# Altium project LLA1305.PrjPcb (part 2 of 2)

## Sheet Power.SchDoc
size A4; SheetNumber: 4; SheetTotal: 11
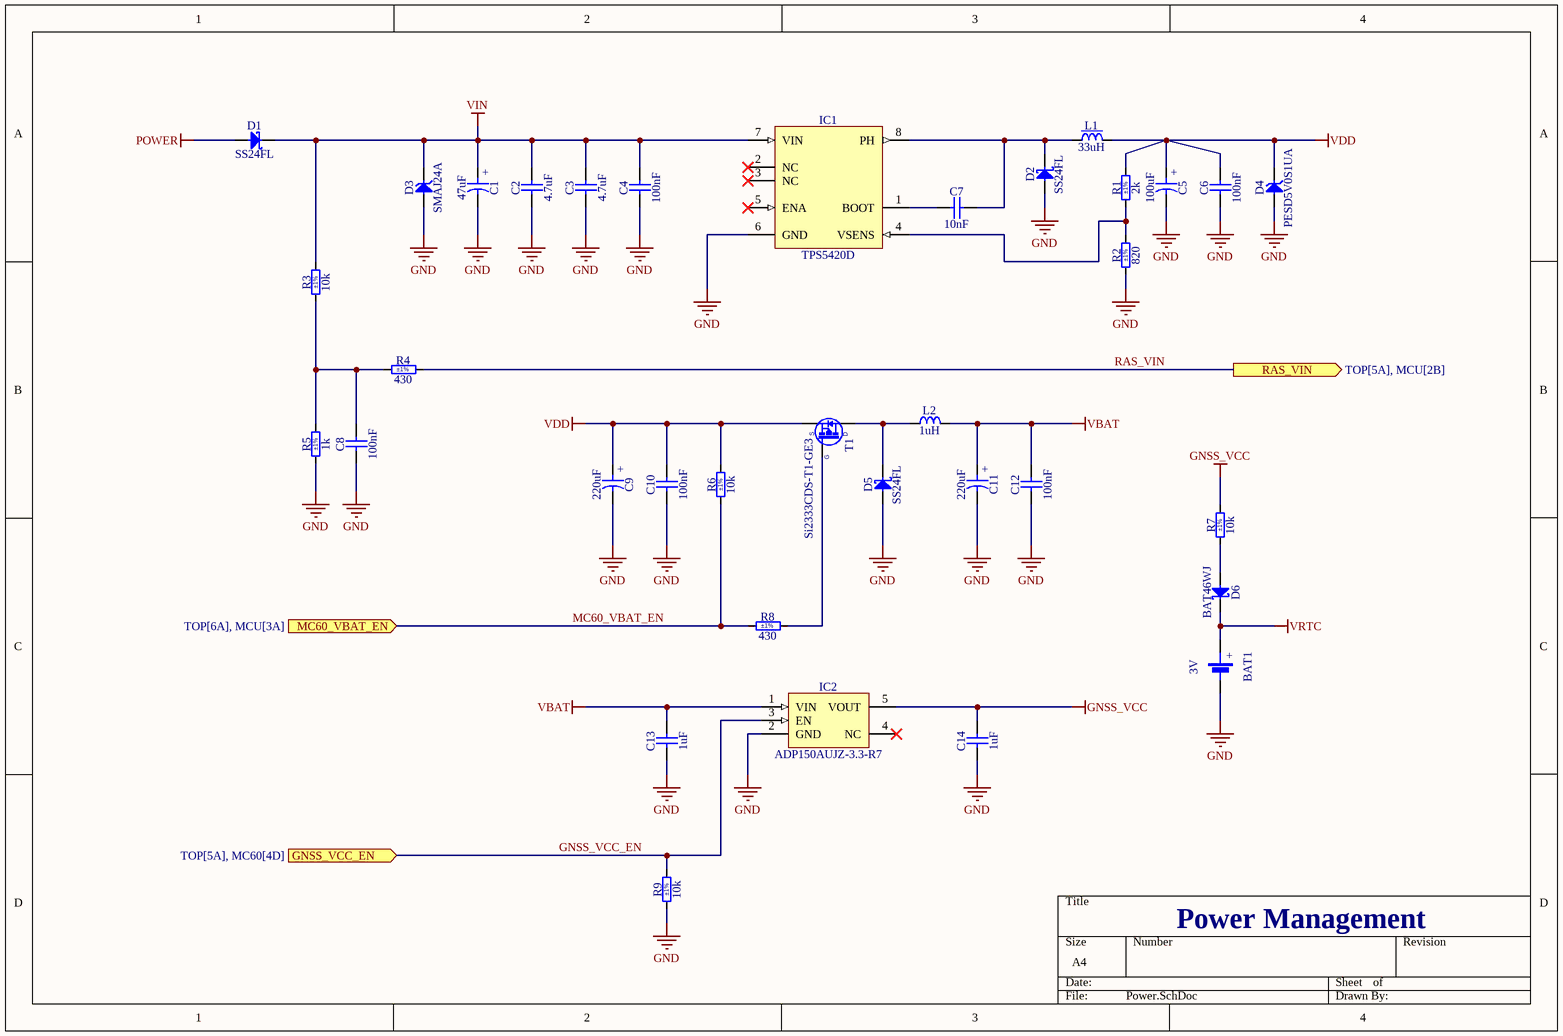
[diagram p7: Power.SchDoc]

### Parts
BAT1  3V  [BAT_SEIKO_ML414H_IV01E]
C1  47uF  [CAPAE660X540N]
C2  4.7uF  [CAPC5750X200N]
C3  4.7uF  [CAPC5750X200N]
C4  100nF  [CAPC1608X90N]
C5  100uF  [CAPMP7343X310N]
C6  100nF  [CAPC1608X87N]
C7  10nF  [CAPC1608X87N]
C8  100nF  [CAPC1608X87N]
C9  220uF  [CAPAE830X620N]
C10  100nF  [CAPC1608X87N]
C11  220uF  [CAPAE830X620N]
C12  100nF  [CAPC1608X87N]
C13  1uF  [CAPC1608X90N]
C14  1uF  [CAPC1608X90N]
D1  SS24FL  [SODFL3617X108N]
D2  SS24FL  [SODFL3617X108N]
D3  SMAJ24A  [DIOM5226X262N]
D4  PESD5V0S1UA  [SOD2512X110N]
D5  SS24FL  [SODFL3617X108N]
D6  BAT46WJ  [SODFL2513X80N]
IC1  TPS5420D  [SOIC127P600X175-8N]
IC2  ADP150AUJZ-3.3-R7  [SOT95P280X90-5N]
L1  33uH  [INDM7066X300N]
L2  1uH  [INDC2520X120N]
R1  2k  Tolerance: ±1%  [RESC1608X55N]
R2  820  Tolerance: ±1%  [RESC1608X55N]
R3  10k  Tolerance: ±1%  [RESC3216X65N]
R4  430  Tolerance: ±1%  [RESC1608X55N]
R5  1k  Tolerance: ±1%  [RESC1608X55N]
R6  10k  Tolerance: ±1%  [RESC1608X55N]
R7  10k  Tolerance: ±1%  [RESC1608X55N]
R8  430  Tolerance: ±1%  [RESC1608X55N]
R9  10k  Tolerance: ±1%  [RESC1608X55N]
T1  Si2333CDS-T1-GE3  [SOT95P237X112-3N]

### Ports
GNSS_VCC_EN (in, see TOP[5A], MC60[4D]), MC60_VBAT_EN (in, see TOP[6A], MCU[3A]), RAS_VIN (out, see TOP[5A], MCU[2B])

### Nets
GND: BAT1.2(MINUS) C1.2 C2.1 C3.1 C4.1 C5.2 C6.1 C8.1 C9.2 C10.1 C11.2 C12.1 C13.1 C14.1 D2.2(A) D3.2(A) D4.2(A) D5.2(A) IC1.6(GND) IC2.2(GND) R2.1 R5.1 R9.1
GNSS_VCC: C14.2 IC2.5(VOUT) R7.2
POWER: D1.2(A)
VBAT: C11.1 C12.2 C13.2 IC2.1(VIN) L2.2
VDD: C5.1 C6.2 C9.1 C10.2 D4.1(C) L1.2 R1.2 R6.2 T1.2(S)
VIN: C1.1 C2.2 C3.2 C4.2 D1.1(C) D3.1(C) IC1.7(VIN) R3.2
VRTC: BAT1.1(PLUS) D6.1(C)
GNSS_VCC_EN: IC2.3(EN) R9.2 ; port GNSS_VCC_EN
MC60_VBAT_EN: R6.1 R8.1 ; port MC60_VBAT_EN
RAS_VIN: R4.2 ; port RAS_VIN
NetC7_1: C7.1 IC1.1(BOOT)
NetC7_2: C7.2 D2.1(C) IC1.8(PH) L1.1
NetC8_2: C8.2 R3.1 R4.1 R5.2
NetD5_1: D5.1(C) L2.1 T1.3(D)
NetD6_2: D6.2(A) R7.1
NetIC1_4: IC1.4(VSENS) R1.1 R2.2
NetR8_2: R8.2 T1.1(G)

Not connected (* = marked no-connect by the designer): IC1 2(NC)* 3(NC)* 5(ENA)*; IC2 4(NC)*

### Notes on the sheet
- Power Management
- (in symbol BAT_SEIKO_ML414H_IV01E) +
- (in symbol CAE660-540_47UF_35V_20%) +
- (in symbol CAE830-620_220UF_10V_20%) +
- (in symbol CTE7343-31_100UF_10V_10%_LESR0050) +

### Library data of the parts
BAT1 = BAT_SEIKO_ML414H_IV01E: Battery 2 Pin; Part Description: Coin, 4.8mm 3 V Lithium Battery Rechargeable (Secondary) 1mAh; Manufacturer: Seiko Instruments; Manufacturer Part Number: ML414H IV01E; PressFit: No; Power: 1mAh; Part Number: BAT_SEIKO_ML414H_IV01E; Component Kind: Standard; Component Type: Standard; Pin Count: 2; PackageDescription: BATTERY LITHIUM 3V RECHARGE; Family: Battery; Mounted: Yes; Socket: No; SMD: Yes; Sense: No; Value: 3V; ComponentHeight: 4.8mm; HelpURL: https://media.digikey.com/PDF/Data%20Sheets/Seiko%20Instruments%20PDFs/ML414H_E.pdf; Author: Xusniyor; CreateDate: 23.04.2023; LatestRevisionDate: 23.04.2023
C1 = CAE660-540_47UF_35V_20%: Polarised capacitor; Part Description: Aluminum Electrolytic SMT Capacitor; Manufacturer: PANASONIC; Manufacturer Part Number: EEEFK1V470AP; Voltage: 35V; Tolerance: ±20%; Part Number: CAE660-540_47UF_35V_20%; Component Kind: Standard; Component Type: Standard; Pin Count: 2; Value: 47uF; Status: Not Recommended; Case: D; Mounted: Yes; Socket: No; SMD: Yes; Sense: No; ComponentHeight: 5.8mm; HelpURL: \\cern.ch\dfs\Applications\Altium\Datasheets\CAE_PANASONIC_FK-V.pdf; Author: CERN DEM JLC; CreateDate: 03.12.2007; LatestRevisionDate: 05.11.2014
C2 C3 = CC2220_4.7UF_100V_10%_X7R: Non-polarised capacitor; Part Description: Multilayer Ceramic Chip Capacitor; Manufacturer: GENERIC; Manufacturer1 Part Number: C5750X7R2A475K230KA; Voltage: 100V; TC: X7R; Tolerance: ±10%; Part Number: CC2220_4.7UF_100V_10%_X7R; Component Kind: Standard; Component Type: Standard; Pin Count: 2; Value: 4.7uF; Status: None; Manufacturer Part Number: CC2220_4.7UF_100V_10%_X7R; Case: 2220; Mounted: Yes; Socket: No; SMD: Yes; Sense: No; Manufacturer1 Example: TDK; Manufacturer1 ComponentHeight: 2.5mm; HelpURL: \\cern.ch\dfs\Applications\Altium\Datasheets\CC2220_X7R_TDK_C_Mid Voltage.pdf; Author: CERN DEM JLC; CreateDate: 31.03.2014; LatestRevisionDate: 30.01.2017
C4 = CC0603_100NF_100V_10%_X7R: Non-polarised capacitor; Part Description: SMD Multilayer Chip Ceramic Capacitor; Manufacturer: GENERIC; Manufacturer1 Part Number: GRM188R72A104KA35D; Voltage: 100V; TC: X7R; Tolerance: ±10%; Part Number: CC0603_100NF_100V_10%_X7R; Component Kind: Standard; Component Type: Standard; Pin Count: 2; Value: 100nF; Status: None; Manufacturer Part Number: CC0603_100NF_100V_10%_X7R; Case: 0603; Mounted: Yes; Socket: No; SMD: Yes; Sense: No; Manufacturer1 Example: MURATA; Manufacturer1 ComponentHeight: 0.9mm; HelpURL: \\cern.ch\dfs\Applications\Altium\Datasheets\CC0603_MURATA_GRM188R72A104KA35D.pdf; Author: CERN DEM JLC; CreateDate: 11.12.2013; LatestRevisionDate: 11.12.2013
C5 = CTE7343-31_100UF_10V_10%_LESR0050: Polarised capacitor; Part Description: Low ESR 0R050 Solid Tantalum Chip Capacitor; Manufacturer: GENERIC; Manufacturer1 Part Number: TPSD107K010R0050; Voltage: 10V; Tolerance: ±10%; Part Number: CTE7343-31_100UF_10V_10%_LESR0050; Component Kind: Standard; Component Type: Standard; Pin Count: 2; Value: 100uF; Status: Preferred; Manufacturer Part Number: CTE7343-31_100UF_10V_10%_LESR0050; Case: D; Mounted: Yes; Socket: No; SMD: Yes; Sense: No; Manufacturer1 Example: AVX; Manufacturer1 ComponentHeight: 3.1mm; HelpURL: \\cern.ch\dfs\Applications\Altium\Datasheets\CTE-LESR_AVX_TPS.pdf; Author: CERN DEM JLC; CreateDate: 05.05.2008; LatestRevisionDate: 20.01.2009
C6 C8 C10 C12 = CC0603_100NF_50V_10%_X7R: Non-polarised capacitor; Part Description: SMD Multilayer Chip Ceramic Capacitor; Manufacturer: GENERIC; Manufacturer1 Part Number: 223858615649; Voltage: 50V; TC: X7R; Tolerance: ±10%; Part Number: CC0603_100NF_50V_10%_X7R; Component Kind: Standard; Component Type: Standard; Pin Count: 2; Value: 100nF; Status: Preferred; Manufacturer Part Number: CC0603_100NF_50V_10%_X7R; Case: 0603; Mounted: Yes; Socket: No; SMD: Yes; Sense: No; Manufacturer1 Example: PHYCOMP; Manufacturer1 ComponentHeight: 0.87mm; HelpURL: \\cern.ch\dfs\Applications\Altium\Datasheets\CC0603_X7R_PHYCOMP.pdf; Author: CERN DEM JLC; CreateDate: 03.12.2007; LatestRevisionDate: 03.12.2007
C7 = CC0603_10NF_50V_10%_X7R: Non-polarised capacitor; Part Description: SMD Multilayer Chip Ceramic Capacitor; Manufacturer: GENERIC; Manufacturer1 Part Number: 223858615636; Voltage: 50V; TC: X7R; Tolerance: ±10%; Part Number: CC0603_10NF_50V_10%_X7R; Component Kind: Standard; Component Type: Standard; Pin Count: 2; Value: 10nF; Status: Preferred; Manufacturer Part Number: CC0603_10NF_50V_10%_X7R; Case: 0603; Mounted: Yes; Socket: No; SMD: Yes; Sense: No; Manufacturer1 Example: PHYCOMP; Manufacturer1 ComponentHeight: 0.87mm; HelpURL: \\cern.ch\dfs\Applications\Altium\Datasheets\CC0603_X7R_PHYCOMP.pdf; Author: CERN DEM JLC; CreateDate: 03.12.2007; LatestRevisionDate: 03.12.2007
C9 C11 = CAE830-620_220UF_10V_20%: Polarised capacitor; Part Description: Aluminum Electrolytic SMT Capacitor; Manufacturer: PANASONIC; Manufacturer Part Number: EEEFK1A221AP; Voltage: 10V; Tolerance: ±20%; Part Number: CAE830-620_220UF_10V_20%; Component Kind: Standard; Component Type: Standard; Pin Count: 2; Value: 220uF; Status: Not Recommended; Case: E; Mounted: Yes; Socket: No; SMD: Yes; Sense: No; ComponentHeight: 6.2mm; HelpURL: \\cern.ch\dfs\Applications\Altium\Datasheets\CAE_PANASONIC_FK-V.pdf; Author: CERN DEM JLC; CreateDate: 03.12.2007; LatestRevisionDate: 05.11.2014
C13 C14 = CC0603_1UF_50V_10%_X7R: Non-polarised capacitor; Part Description: SMD Multilayer Chip Ceramic Capacitor; Manufacturer: GENERIC; Manufacturer1 Part Number: CC0603KRX7R9BB105; Voltage: 50V; TC: X7R; Tolerance: ±10%; Part Number: CC0603_1UF_50V_10%_X7R; Component Kind: Standard; Component Type: Standard; Pin Count: 2; Value: 1uF; Status: None; Manufacturer Part Number: CC0603_1UF_50V_10%_X7R; Case: 0603; Mounted: Yes; Socket: No; SMD: Yes; Sense: No; Manufacturer1 Example: YAGEO PHYCOMP; Manufacturer1 ComponentHeight: 0.9mm; HelpURL: \\cern.ch\dfs\Applications\Altium\Datasheets\CC0603_X7R_PHYCOMP.pdf; Author: CERN DEM BC; CreateDate: 20.08.2020; LatestRevisionDate: 20.08.2020
D1 D2 D5 = SS24FL: Schottky Diode; Part Description: Surface Mount Schottky Barrier Rectifier; Manufacturer: ON SEMICONDUCTOR; Voltage: 40V; Power: 2A; PressFit: No; Bonding: No; Part Number: SS24FL; Component Kind: Standard; Component Type: Standard; Device: SS24FL; PackageDescription: SODFL Diode (SOD123FL); 2.75mm W X 1.72mm L X 1.08mm H body, IPC Medium Density; Manufacturer Part Number: SS24FL; Pin Count: 2; Case: SOD-123FL; Mounted: Yes; Socket: No; SMD: Yes; Sense: No; ComponentHeight: 1.08mm; HelpURL: \\cern.ch\dfs\Applications\Altium\Datasheets\SS24FL.pdf; Author: CERN DEM BC; CreateDate: 06.10.2020; LatestRevisionDate: 06.10.2020
D3 = SMAJ24A: Transient Voltage Suppressor Diode (Uni-Directional); Part Description: Surface Mount Uni-directional Transient Voltage Suppressor Diode; Manufacturer: BOURNS; Voltage: 24V; Power: 400W; PressFit: No; Bonding: No; Part Number: SMAJ24A; Component Kind: Standard; Component Type: Standard; Device: SMAJ24A; PackageDescription: DO-214-AC/SMA Diode, Molded Body; 5.21mm L X 2.605mm W X 2.62mm H, IPC Medium Density; Manufacturer Part Number: SMAJ24A; Pin Count: 2; Case: DO-214AC; Mounted: Yes; Socket: No; SMD: Yes; Sense: No; ComponentHeight: 2.62mm; HelpURL: \\cern.ch\dfs\Applications\Altium\Datasheets\SMAJ24A.pdf; Author: CERN DEM JLC; CreateDate: 27.06.2011; LatestRevisionDate: 27.06.2011
D4 = PESD5V0S1UA: Transient Voltage Suppressor Diode (Uni-Directional); Part Description: Unidirectional ESD Protection for Transient Voltage Suppression; Manufacturer: NXP SEMICONDUCTORS; Voltage: 5V; Power: 890W; PressFit: No; Bonding: No; Part Number: PESD5V0S1UA; Component Kind: Standard; Component Type: Standard; Device: PESD5V0S1UA; PackageDescription: Small Outline Diode (SOD-323), 1.70mm W X 1.25mm L X 1.10mm H body,  IPC Medium Density; Manufacturer Part Number: PESD5V0S1UA; Pin Count: 2; Case: SOD323; Mounted: Yes; Socket: No; SMD: Yes; Sense: No; ComponentHeight: 1.1mm; HelpURL: \\cern.ch\dfs\Applications\Altium\Datasheets\PESD5V0S1UA.pdf; Author: CERN DEM JLC; CreateDate: 28.08.2012; LatestRevisionDate: 18.09.2013
D6 = BAT46WJ: Schottky Diode; Part Description: Single Schottky Barrier Diode; Manufacturer: NEXPERIA; Voltage: 100V; Power: 250mA; PressFit: No; Bonding: No; Part Number: BAT46WJ; Component Kind: Standard; Component Type: Standard; Device: BAT46WJ; PackageDescription: SODFL Diode (SOD323F); 1.70mm W X 1.25mm L X 0.80mm H body, IPC Medium Density; Manufacturer Part Number: BAT46WJ; Pin Count: 2; Case: SOD-323F; Mounted: Yes; Socket: No; SMD: Yes; Sense: No; ComponentHeight: 0.8mm; HelpURL: \\cern.ch\dfs\Applications\Altium\Datasheets\BAT46WJ.pdf; Author: CERN DEM JLC; CreateDate: 18.01.2018; LatestRevisionDate: 18.01.2018
IC1 = TPS5420D: 2A, Wide Input Range, Step-Down SWIFT Converter; Manufacturer: TEXAS INSTRUMENTS; PressFit: No; Bonding: No; Part Number: TPS5420D; Component Kind: Standard; Component Type: Standard; Device: TPS5420D; PackageDescription: SOIC 8, Pitch 1.27mm, Body 4x5mm, IPC Medium Density; Part Description: 2A, Wide Input Range, Step-Down SWIFT Converter; Manufacturer Part Number: TPS5420D; Pin Count: 8; Case: SOIC8; Mounted: Yes; Socket: No; SMD: Yes; Sense: No; ComponentHeight: 1.75mm; HelpURL: \\cern.ch\dfs\Applications\Altium\Datasheets\TPS5420D.pdf; Author: CERN DEM JLC; CreateDate: 17.11.2009; LatestRevisionDate: 07.12.2011
IC2 = ADP150AUJZ-3.3-R7: Ultralow Noise, 150 mA CMOS Linear Regulator; Part Description: 3.3V, 150mA, Ultralow Noise, CMOS Linear Regulator; Manufacturer: ANALOG DEVICES; PressFit: No; Bonding: No; Part Number: ADP150AUJZ-3.3-R7; Component Kind: Standard; Component Type: Standard; Device: ADP150AUJZ-3.3-R7; PackageDescription: SOT23, 0.95mm pitch; 5 pin, 1.75mm W X 3.00mm L, IPC Medium Density; Manufacturer Part Number: ADP150AUJZ-3.3-R7; Pin Count: 5; Case: SOT23; Mounted: Yes; Socket: No; SMD: Yes; Sense: No; ComponentHeight: 0.9mm; HelpURL: \\cern.ch\dfs\Applications\Altium\Datasheets\ADP150AUJZ-3.3-R7.pdf; Author: CERN DEM JLC; CreateDate: 27.09.2011; LatestRevisionDate: 19.06.2014
L1 = IND_33UH_20%_FXL0630-330-M: Inductor With Core; Part Description: 2A 33uH ±20% 2.5A SMD,6.6x7mm Power Inductors ROHS; Manufacturer: Changjiang Microelectronics Tech; Power: 2A; Resistance: 0.280R; Tolerance: ±20%; Part Number: IND_33UH_20%_FXL0630-330-M; Component Kind: Standard; Component Type: Standard; Pin Count: 2; Value: 33uH; Manufacturer Part Number: FXL0630-330-M; Case: 6.6x7; Mounted: Yes; Socket: No; SMD: Yes; Sense: No; ComponentHeight: 2.8mm; HelpURL: https://datasheet.lcsc.com/lcsc/1810111121_cjiang--Changjiang-Microelectronics-Tech-FXL0630-330-M_C177245.pdf; Author: Xusniyor; CreateDate: 01.05.2023; LatestRevisionDate: 01.05.2023
L2 = IND1008_1UH_20%_MURATA_DFE252012P-1R0M=P2: Inductor; Part Description: 1 µH Shielded Drum Core, Wirewound Inductor 4.3 A 42mOhm Max 1008 (2520 Metric); Manufacturer: MURATA; Power: 4.3A; Resistance: 0.042A; Tolerance: ±20%; Part Number: IND1008_1UH_20%_MURATA_DFE252012P-1R0M=P2; Component Kind: Standard; Component Type: Standard; Pin Count: 2; Value: 1uH; Manufacturer Part Number: DFE252012P-1R0M=P2; Case: 1008; Mounted: Yes; Socket: No; SMD: Yes; Sense: No; ComponentHeight: 1.2mm; HelpURL: https://www.murata.com/~/media/webrenewal/products/inductor/chip/tokoproducts/wirewoundmetalalloychiptype/m_dfe252012p.ashx; Author: Xusniyor; CreateDate: 12.02.2023; LatestRevisionDate: 12.02.2023
R1 = R0603_2K_1%_0.1W_100PPM: Resistor - 1%; Part Description: General Purpose Thick Film Chip Resistor; Manufacturer: GENERIC; Manufacturer1 Part Number: NRC06F2001TRF; Power: 0.1W; TC: ±100ppm/°C; PressFit: No; Part Number: R0603_2K_1%_0.1W_100PPM; Component Kind: Standard; Component Type: Standard; Pin Count: 2; Value: 2k; Status: Preferred; Manufacturer Part Number: R0603_2K_1%_0.1W_100PPM; Case: 0603; Mounted: Yes; Sense: No; Socket: No; SMD: Yes; Manufacturer1 Example: NIC COMPONENT; Manufacturer1 ComponentHeight: 0.55mm; HelpURL: \\cern.ch\dfs\Applications\Altium\Datasheets\R0603_NIC_NRC.pdf; Author: CERN DEM JLC; CreateDate: 03.12.2007; LatestRevisionDate: 13.03.2008
R2 = R0603_820R_1%_0.1W_100PPM: Resistor - 1%; Part Description: General Purpose Thick Film Chip Resistor; Manufacturer: GENERIC; Manufacturer1 Part Number: NRC06F8200TRF; Power: 0.1W; TC: ±100ppm/°C; PressFit: No; Part Number: R0603_820R_1%_0.1W_100PPM; Component Kind: Standard; Component Type: Standard; Pin Count: 2; Value: 820; Status: Preferred; Manufacturer Part Number: R0603_820R_1%_0.1W_100PPM; Case: 0603; Mounted: Yes; Sense: No; Socket: No; SMD: Yes; Manufacturer1 Example: NIC COMPONENT; Manufacturer1 ComponentHeight: 0.55mm; HelpURL: \\cern.ch\dfs\Applications\Altium\Datasheets\R0603_NIC_NRC.pdf; Author: CERN DEM JLC; CreateDate: 03.12.2007; LatestRevisionDate: 13.03.2008
R3 = R1206_10K_1%_0.25W_100PPM: Resistor - 1%; Part Description: General Purpose Thick Film Chip Resistor; Manufacturer: GENERIC; Manufacturer1 Part Number: NRC12F1002TRF; Power: 0.25W; TC: ±100ppm/°C; PressFit: No; Part Number: R1206_10K_1%_0.25W_100PPM; Component Kind: Standard; Component Type: Standard; Pin Count: 2; Value: 10k; Status: Preferred; Manufacturer Part Number: R1206_10K_1%_0.25W_100PPM; Case: 1206; Mounted: Yes; Sense: No; Socket: No; SMD: Yes; Manufacturer1 Example: NIC COMPONENT; Manufacturer1 ComponentHeight: 0.65mm; HelpURL: \\cern.ch\dfs\Applications\Altium\Datasheets\R1206_NIC_NRC.pdf; Author: CERN DEM JLC; CreateDate: 03.12.2007; LatestRevisionDate: 13.03.2008
R4 R8 = R0603_430R_1%_0.1W_100PPM: Resistor - 1%; Part Description: General Purpose Thick Film Chip Resistor; Manufacturer: GENERIC; Manufacturer1 Part Number: NRC06F4300TRF; Power: 0.1W; TC: ±100ppm/°C; PressFit: No; Part Number: R0603_430R_1%_0.1W_100PPM; Component Kind: Standard; Component Type: Standard; Pin Count: 2; Value: 430; Status: Preferred; Manufacturer Part Number: R0603_430R_1%_0.1W_100PPM; Case: 0603; Mounted: Yes; Sense: No; Socket: No; SMD: Yes; Manufacturer1 Example: NIC COMPONENT; Manufacturer1 ComponentHeight: 0.55mm; HelpURL: \\cern.ch\dfs\Applications\Altium\Datasheets\R0603_NIC_NRC.pdf; Author: CERN DEM JLC; CreateDate: 03.12.2007; LatestRevisionDate: 13.03.2008
R5 = R0603_1K_1%_0.1W_100PPM: Resistor - 1%; Part Description: General Purpose Thick Film Chip Resistor; Manufacturer: GENERIC; Manufacturer1 Part Number: NRC06F1001TRF; Power: 0.1W; TC: ±100ppm/°C; PressFit: No; Part Number: R0603_1K_1%_0.1W_100PPM; Component Kind: Standard; Component Type: Standard; Pin Count: 2; Value: 1k; Status: Preferred; Manufacturer Part Number: R0603_1K_1%_0.1W_100PPM; Case: 0603; Mounted: Yes; Sense: No; Socket: No; SMD: Yes; Manufacturer1 Example: NIC COMPONENT; Manufacturer1 ComponentHeight: 0.55mm; HelpURL: \\cern.ch\dfs\Applications\Altium\Datasheets\R0603_NIC_NRC.pdf; Author: CERN DEM JLC; CreateDate: 03.12.2007; LatestRevisionDate: 13.03.2008
R6 R7 R9 = R0603_10K_1%_0.1W_100PPM: Resistor - 1%; Part Description: General Purpose Thick Film Chip Resistor; Manufacturer: GENERIC; Manufacturer1 Part Number: NRC06F1002TRF; Power: 0.1W; TC: ±100ppm/°C; PressFit: No; Part Number: R0603_10K_1%_0.1W_100PPM; Component Kind: Standard; Component Type: Standard; Pin Count: 2; Value: 10k; Status: Preferred; Manufacturer Part Number: R0603_10K_1%_0.1W_100PPM; Case: 0603; Mounted: Yes; Sense: No; Socket: No; SMD: Yes; Manufacturer1 Example: NIC COMPONENT; Manufacturer1 ComponentHeight: 0.55mm; HelpURL: \\cern.ch\dfs\Applications\Altium\Datasheets\R0603_NIC_NRC.pdf; Author: CERN DEM JLC; CreateDate: 03.12.2007; LatestRevisionDate: 13.03.2008
T1 = Si2333CDS-T1-GE3: P-CHANNEL MOSFET WITH DIODE; Part Description: -12V -5.1A P-Channel  TrenchFET® Power MOSFET; Manufacturer: VISHAY SILICONIX; PressFit: No; Bonding: No; Part Number: Si2333CDS-T1-GE3; Component Kind: Standard; Component Type: Standard; Device: Si2333CDS-T1-GE3; PackageDescription: SOT23, 0.95mm Pitch; 3 Pin, 1.30mm W X 2.92mm L X 1.12mm H body, IPC Medium Density; Manufacturer Part Number: Si2333CDS-T1-GE3; Pin Count: 3; Case: SOT23-3; Mounted: Yes; Socket: No; SMD: Yes; Sense: No; ComponentHeight: 1.12mm; HelpURL: \\cern.ch\dfs\Applications\Altium\Datasheets\Si2333CDS-T1-GE3.pdf; Author: CERN DEM JLC; CreateDate: 03.03.2011; LatestRevisionDate: 02.05.2011

## Sheet RS485.SchDoc
size A4; SheetNumber: 10; SheetTotal: 11
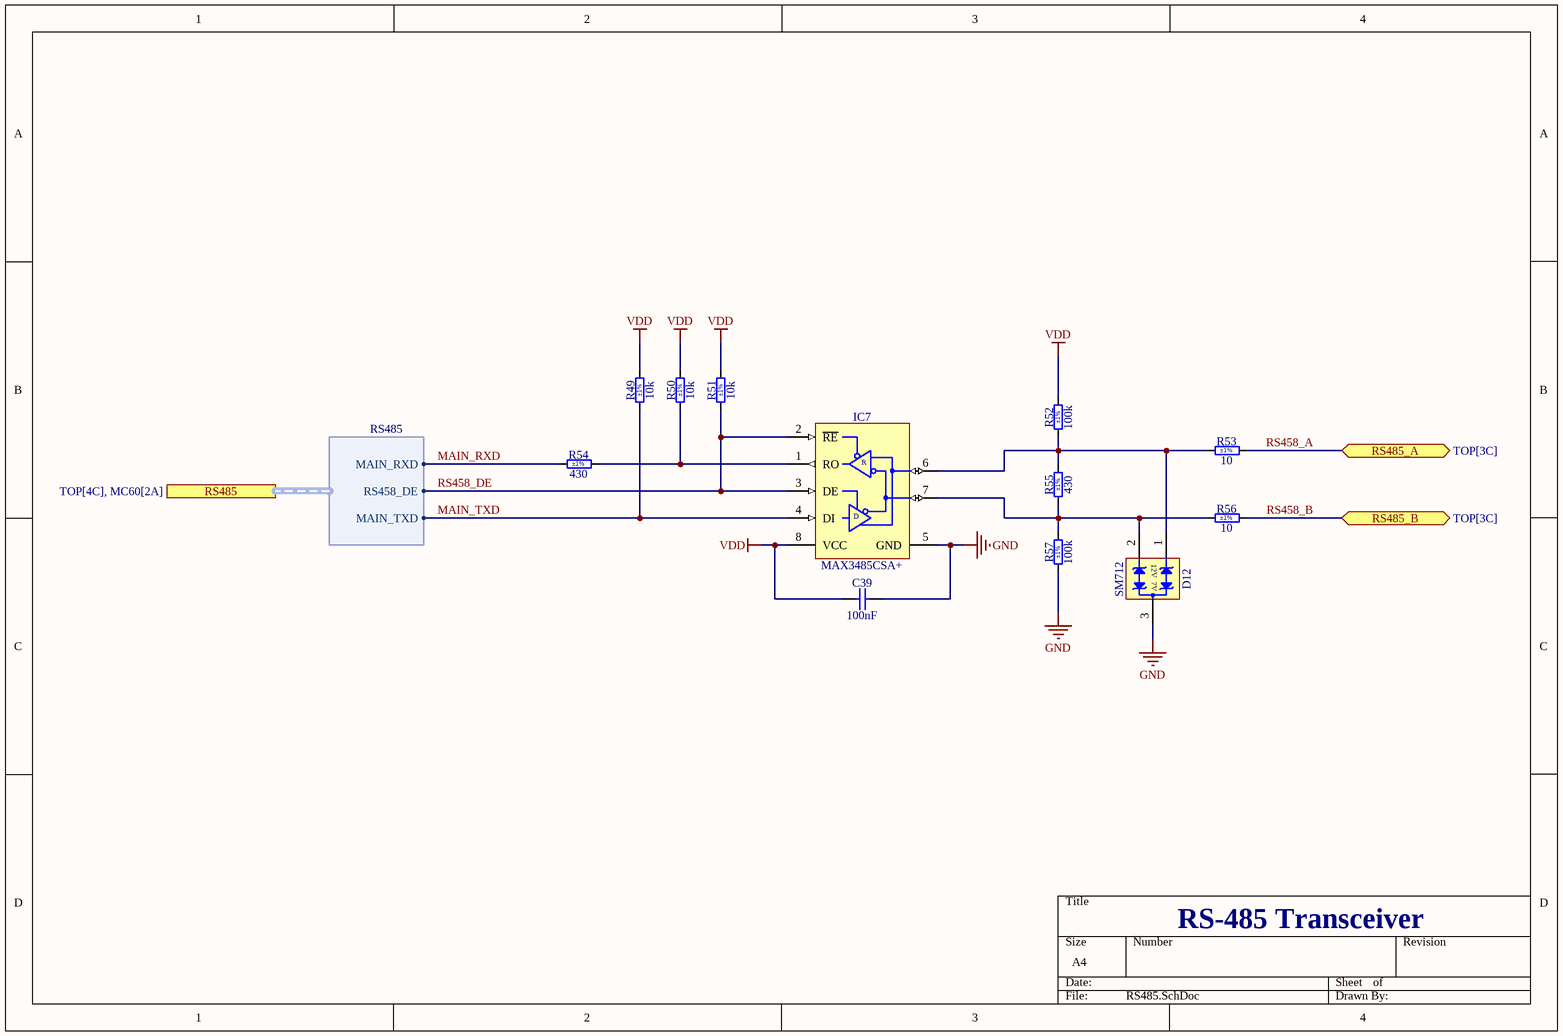
[diagram p8: RS485.SchDoc]

### Parts
C39  100nF  [CAPC1608X87N]
D12  SM712  [SOT95P237X112-3N]
IC7  MAX3485CSA+  [SOIC127P600X175-8N]
R49  10k  Tolerance: ±1%  [RESC1608X55N]
R50  10k  Tolerance: ±1%  [RESC1608X55N]
R51  10k  Tolerance: ±1%  [RESC1608X55N]
R52  100k  Tolerance: ±1%  [RESC1608X55N]
R53  10  Tolerance: ±1%  [RESC1608X55N]
R54  430  Tolerance: ±1%  [RESC1608X55N]
R55  430  Tolerance: ±1%  [RESC1608X55N]
R56  10  Tolerance: ±1%  [RESC1608X55N]
R57  100k  Tolerance: ±1%  [RESC1608X55N]

### Ports
RS485 (harness RS485, see TOP[4C], MC60[2A]), RS485_A (bidir, see TOP[3C]), RS485_B (bidir, see TOP[3C])

### Harnesses
RS485: MAIN_RXD, RS458_DE, MAIN_TXD

### Nets
GND: C39.2 D12.3(GND) IC7.5(GND) R57.1
VDD: C39.1 IC7.8(VCC) R49.2 R50.2 R51.2 R52.2
MAIN_RXD: R54.1 ; port RS485.MAIN_RXD
MAIN_TXD: IC7.4(DI) R49.1 ; port RS485.MAIN_TXD
RS458_A: R53.2 ; port RS485_A
RS458_B: R56.2 ; port RS485_B
RS458_DE: IC7.2(~{RE}) IC7.3(DE) R51.1 ; port RS485.RS458_DE
NetD12_1: D12.1(I/O1) IC7.6(A) R52.1 R53.1 R55.2
NetD12_2: D12.2(I/O2) IC7.7(B) R55.1 R56.1 R57.2
NetIC7_1: IC7.1(RO) R50.1 R54.2

### Notes on the sheet
- RS-485 Transceiver
- (in symbol MAX3485CSA+) R; D
- (in symbol SM712) 12V; 7V

### Library data of the parts
C39 = CC0603_100NF_50V_10%_X7R: as C6 on sheet Power; Part Number: CC0603_100NF_50V_10%_X7R; Component Kind: Standard; Component Type: Standard; Pin Count: 2; Value: 100nF; Status: Preferred; Manufacturer Part Number: CC0603_100NF_50V_10%_X7R; Case: 0603; Mounted: Yes; Socket: No; SMD: Yes; Sense: No; Manufacturer1 Example: PHYCOMP; Manufacturer1 ComponentHeight: 0.87mm; HelpURL: \\cern.ch\dfs\Applications\Altium\Datasheets\CC0603_X7R_PHYCOMP.pdf; Author: CERN DEM JLC; CreateDate: 03.12.2007; LatestRevisionDate: 03.12.2007
D12 = SM712: Asymmetrical TVS Diode for Extended Common-Mode RS-485; Manufacturer: SEMTECH; Voltage: 12V/-7V; Power: 400W; PressFit: No; Bonding: No; Part Number: SM712; Component Kind: Standard; Component Type: Standard; Device: SM712; PackageDescription: SOT, 0.95mm Pitch; 3 Pin, 1.30mm W X 2.92mm L X 1.12mm H body, IPC Medium Density; Status: Obsolete; Part Description: Asymmetrical TVS Diode for Extended Common-Mode RS-485; Manufacturer Part Number: SM712; Pin Count: 3; Case: SOT23-3; Mounted: Yes; Socket: No; SMD: Yes; Sense: No; ComponentHeight: 1.12mm; HelpURL: \\cern.ch\dfs\Applications\Altium\Datasheets\SM712.pdf; Author: CERN DEM JLC; CreateDate: 23.04.2012; LatestRevisionDate: 23.04.2012
IC7 = MAX3485CSA+: 3.3V-Powered, ±15kV ESD-Protected, 10Mbps,True RS-485/RS-422 Half Duplex Transceiver; Manufacturer: MAXIM; PressFit: No; Bonding: No; Part Number: MAX3485CSA+; Component Kind: Standard; Component Type: Standard; Device: MAX3485CSA+; PackageDescription: SOIC, 1.27mm Pitch; 8 Pin - Body 4x5mm, IPC Medium Density; Part Description: 3.3V-Powered, ±15kV ESD-Protected, 10Mbps,True RS-485/RS-422 Half Duplex Transceiver; Manufacturer Part Number: MAX3485CSA+; Pin Count: 8; Case: SOIC8; Mounted: Yes; Socket: No; SMD: Yes; Sense: No; ComponentHeight: 1.75mm; HelpURL: \\cern.ch\dfs\Applications\Altium\Datasheets\MAX3485CSA+.pdf; Author: CERN DEM JLC; CreateDate: 05.10.2009; LatestRevisionDate: 05.10.2009
R49-R51 = R0603_10K_1%_0.1W_100PPM: as R6 on sheet Power; Part Number: R0603_10K_1%_0.1W_100PPM; Component Kind: Standard; Component Type: Standard; Pin Count: 2; Value: 10k; Status: Preferred; Manufacturer Part Number: R0603_10K_1%_0.1W_100PPM; Case: 0603; Mounted: Yes; Sense: No; Socket: No; SMD: Yes; Manufacturer1 Example: NIC COMPONENT; Manufacturer1 ComponentHeight: 0.55mm; HelpURL: \\cern.ch\dfs\Applications\Altium\Datasheets\R0603_NIC_NRC.pdf; Author: CERN DEM JLC; CreateDate: 03.12.2007; LatestRevisionDate: 13.03.2008
R52 R57 = R0603_100K_1%_0.1W_100PPM: Resistor - 1%; Part Description: General Purpose Thick Film Chip Resistor; Manufacturer: GENERIC; Manufacturer1 Part Number: NRC06F1003TRF; Power: 0.1W; TC: ±100ppm/°C; PressFit: No; Part Number: R0603_100K_1%_0.1W_100PPM; Component Kind: Standard; Component Type: Standard; Pin Count: 2; Value: 100k; Status: Preferred; Manufacturer Part Number: R0603_100K_1%_0.1W_100PPM; Case: 0603; Mounted: Yes; Sense: No; Socket: No; SMD: Yes; Manufacturer1 Example: NIC COMPONENT; Manufacturer1 ComponentHeight: 0.55mm; HelpURL: \\cern.ch\dfs\Applications\Altium\Datasheets\R0603_NIC_NRC.pdf; Author: CERN DEM JLC; CreateDate: 03.12.2007; LatestRevisionDate: 13.03.2008
R53 R56 = R0603_10R_1%_0.1W_200PPM: Resistor - 1%; Part Description: General Purpose Thick Film Chip Resistor; Manufacturer: GENERIC; Manufacturer1 Part Number: NRC06F10R0TRF; Power: 0.1W; TC: ±200ppm/°C; PressFit: No; Part Number: R0603_10R_1%_0.1W_200PPM; Component Kind: Standard; Component Type: Standard; Pin Count: 2; Value: 10; Status: Preferred; Manufacturer Part Number: R0603_10R_1%_0.1W_200PPM; Case: 0603; Mounted: Yes; Sense: No; Socket: No; SMD: Yes; Manufacturer1 Example: NIC COMPONENT; Manufacturer1 ComponentHeight: 0.55mm; HelpURL: \\cern.ch\dfs\Applications\Altium\Datasheets\R0603_NIC_NRC.pdf; Author: CERN DEM JLC; CreateDate: 03.12.2007; LatestRevisionDate: 24.06.2009
R54 R55 = R0603_430R_1%_0.1W_100PPM: as R4 on sheet Power; Part Number: R0603_430R_1%_0.1W_100PPM; Component Kind: Standard; Component Type: Standard; Pin Count: 2; Value: 430; Status: Preferred; Manufacturer Part Number: R0603_430R_1%_0.1W_100PPM; Case: 0603; Mounted: Yes; Sense: No; Socket: No; SMD: Yes; Manufacturer1 Example: NIC COMPONENT; Manufacturer1 ComponentHeight: 0.55mm; HelpURL: \\cern.ch\dfs\Applications\Altium\Datasheets\R0603_NIC_NRC.pdf; Author: CERN DEM JLC; CreateDate: 03.12.2007; LatestRevisionDate: 13.03.2008

## Sheet IOs.SchDoc
size A3; SheetNumber: 8; SheetTotal: 11
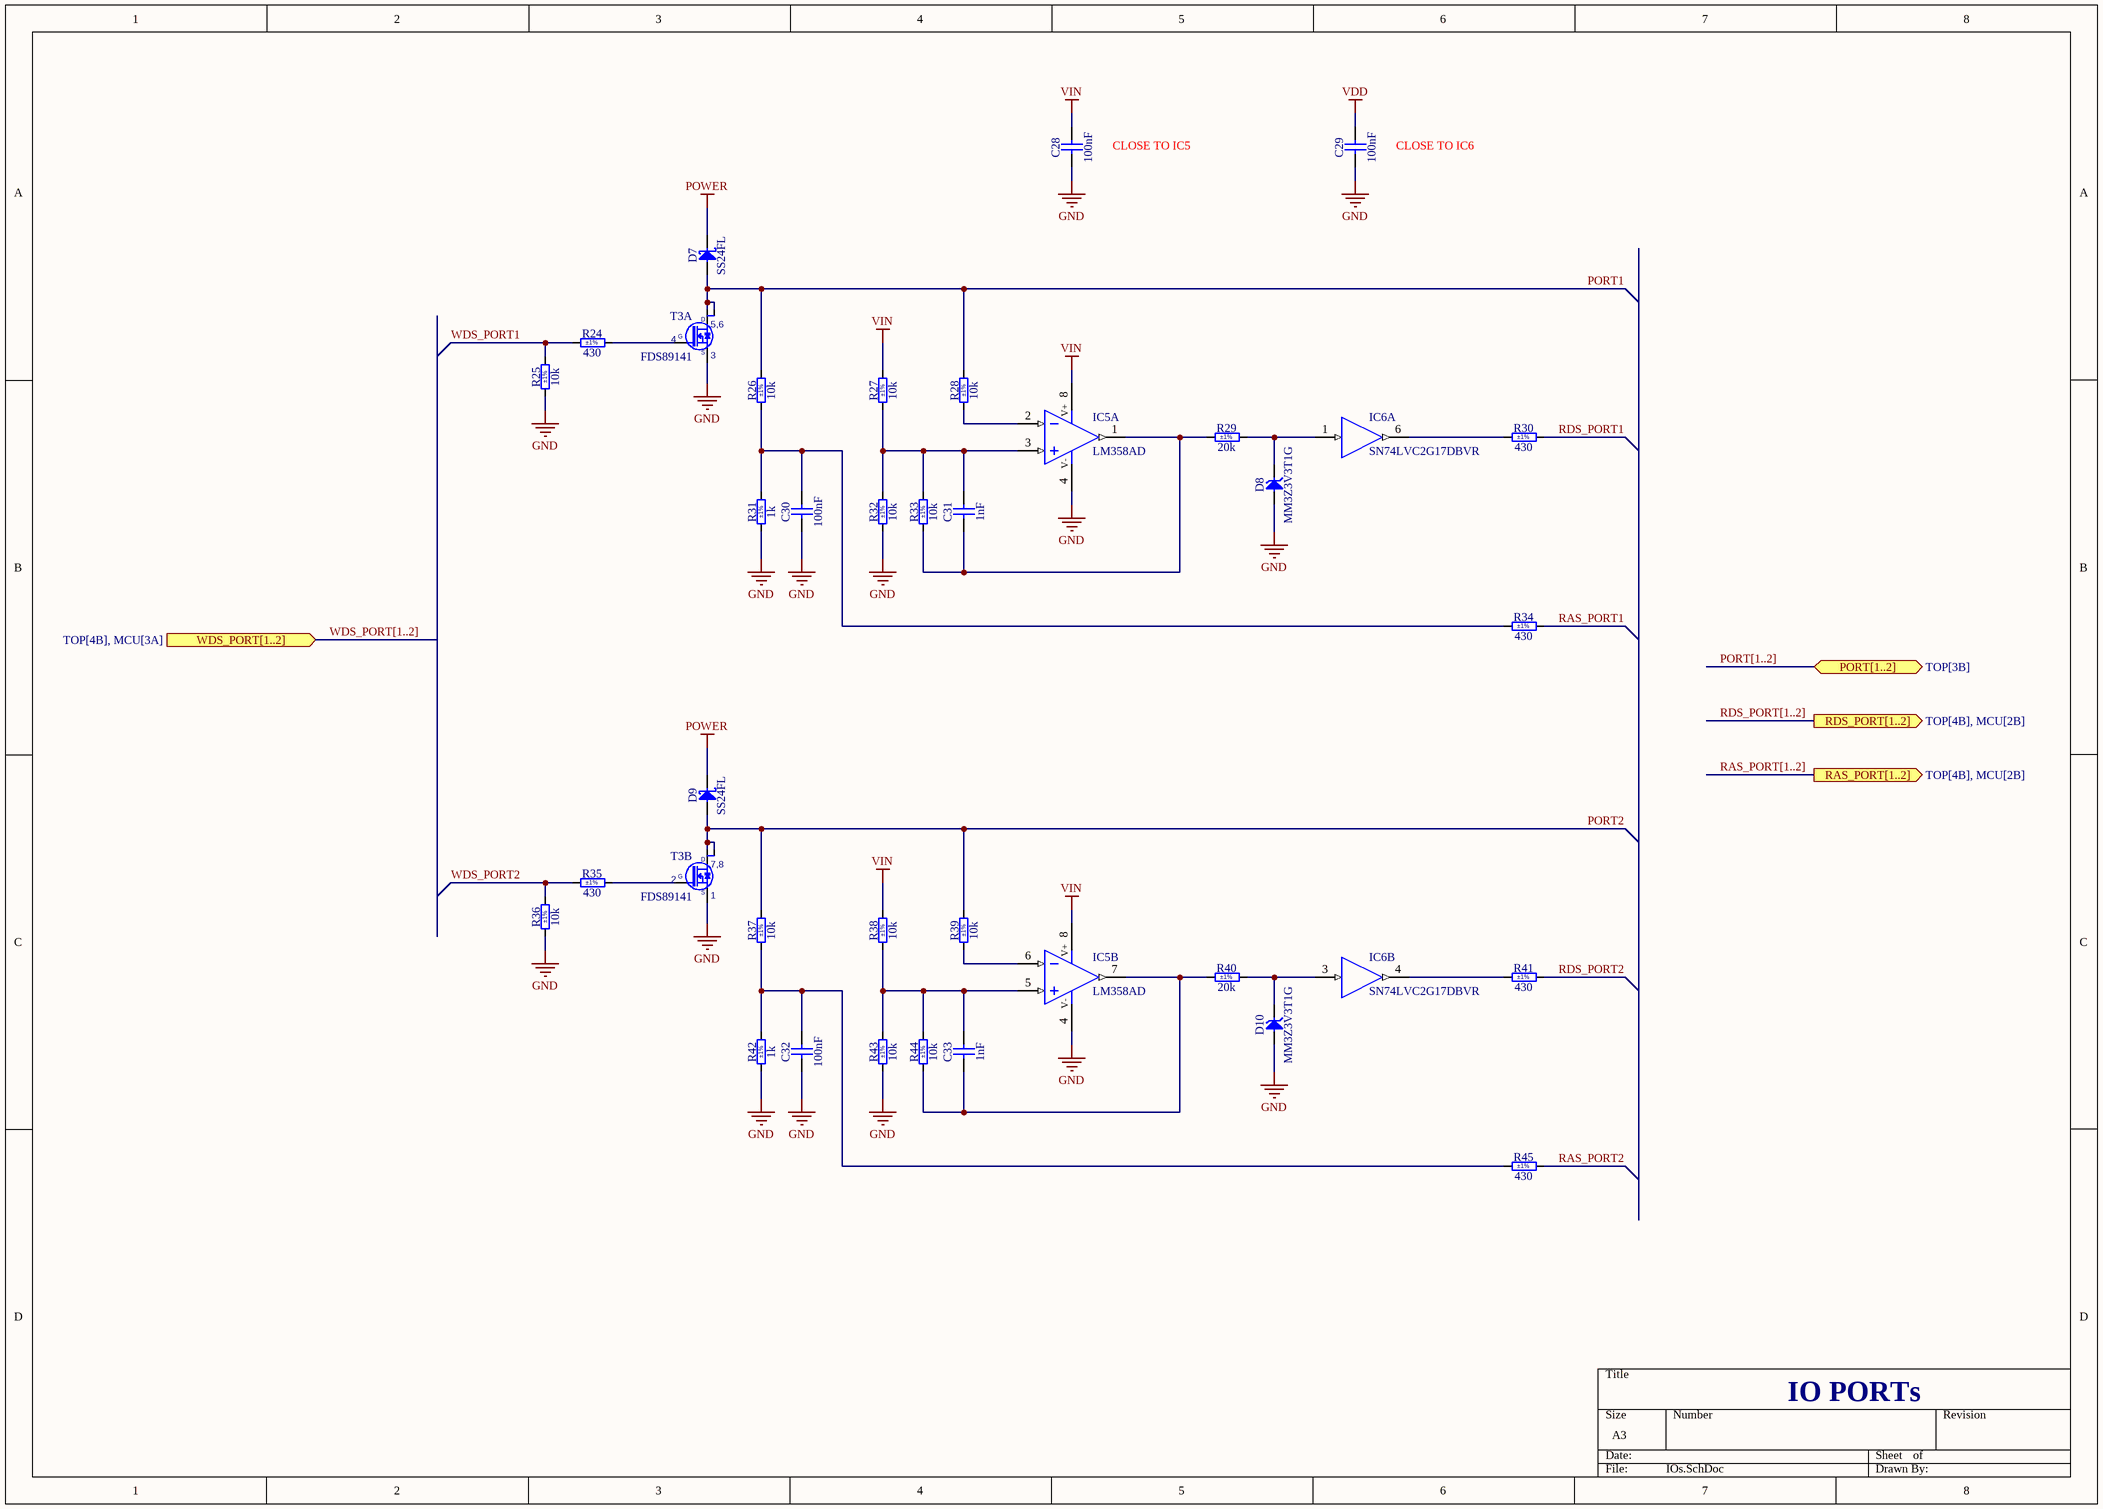
[diagram p9: IOs.SchDoc]

### Parts
C28  100nF  [CAPC1608X90N]
C29  100nF  [CAPC1608X87N]
C30  100nF  [CAPC1608X87N]
C31  1nF  [CAPC1608X87N]
C32  100nF  [CAPC1608X87N]
C33  1nF  [CAPC1608X87N]
D7  SS24FL  [SODFL3617X108N]
D8  MM3Z3V3T1G  [SOD2512X110N]
D9  SS24FL  [SODFL3617X108N]
D10  MM3Z3V3T1G  [SOD2512X110N]
IC5  LM358AD  [SOIC127P600X175-8N]  (parts A,B of 2)
IC6  SN74LVC2G17DBVR  [SOT95P280X145-6N]  (parts A,B of 2)
R24  430  Tolerance: ±1%  [RESC1608X55N]
R25  10k  Tolerance: ±1%  [RESC1608X55N]
R26  10k  Tolerance: ±1%  [RESC3216X65N]
R27  10k  Tolerance: ±1%  [RESC1608X55N]
R28  10k  Tolerance: ±1%  [RESC1608X55N]
R29  20k  Tolerance: ±1%  [RESC1608X55N]
R30  430  Tolerance: ±1%  [RESC1608X55N]
R31  1k  Tolerance: ±1%  [RESC1608X55N]
R32  10k  Tolerance: ±1%  [RESC1608X55N]
R33  10k  Tolerance: ±1%  [RESC1608X55N]
R34  430  Tolerance: ±1%  [RESC1608X55N]
R35  430  Tolerance: ±1%  [RESC1608X55N]
R36  10k  Tolerance: ±1%  [RESC1608X55N]
R37  10k  Tolerance: ±1%  [RESC3216X65N]
R38  10k  Tolerance: ±1%  [RESC1608X55N]
R39  10k  Tolerance: ±1%  [RESC1608X55N]
R40  20k  Tolerance: ±1%  [RESC1608X55N]
R41  430  Tolerance: ±1%  [RESC1608X55N]
R42  1k  Tolerance: ±1%  [RESC1608X55N]
R43  10k  Tolerance: ±1%  [RESC1608X55N]
R44  10k  Tolerance: ±1%  [RESC1608X55N]
R45  430  Tolerance: ±1%  [RESC1608X55N]
T3  FDS89141  [SOIC127P600X175-8N]  (parts A,B of 2)

### Ports
PORT[1..2] (bidir, see TOP[3B]), RAS_PORT[1..2] (out, see TOP[4B], MCU[2B]), RDS_PORT[1..2] (out, see TOP[4B], MCU[2B]), WDS_PORT[1..2] (in, see TOP[4B], MCU[3A])

### Nets
GND: C28.1 C29.1 C30.1 C32.1 D8.2(A) D10.2(A) IC5.4(V-) IC6.2(GND) R25.1 R31.1 R32.1 R36.1 R42.1 R43.1 T3.1(S) T3.3(S)
POWER: D7.1(C) D9.1(C)
VDD: C29.2 IC6.5(VCC)
VIN: C28.2 IC5.8(V+) R27.2 R38.2
PORT1: D7.2(A) R26.2 R28.2 T3.5(D) T3.6(D)
PORT2: D9.2(A) R37.2 R39.2 T3.7(D) T3.8(D)
RAS_PORT1: R34.2
RAS_PORT2: R45.2
RDS_PORT1: R30.2
RDS_PORT2: R41.2
WDS_PORT1: R24.1 R25.2
WDS_PORT2: R35.1 R36.2
NetC30_2: C30.2 R26.1 R31.2 R34.1
NetC31_1: C31.1 IC5.1(OUT) R29.1 R33.1
NetC31_2: C31.2 IC5.3(IN+) R27.1 R32.2 R33.2
NetC32_2: C32.2 R37.1 R42.2 R45.1
NetC33_1: C33.1 IC5.7(OUT) R40.1 R44.1
NetC33_2: C33.2 IC5.5(IN+) R38.1 R43.2 R44.2
NetD8_1: D8.1(C) IC6.1(IN) R29.2
NetD10_1: D10.1(C) IC6.3(IN) R40.2
NetIC5_2: IC5.2(IN-) R28.1
NetIC5_6: IC5.6(IN-) R39.1
NetIC6_4: IC6.4(OUT) R41.1
NetIC6_6: IC6.6(OUT) R30.1
NetR24_2: R24.2 T3.4(G)
NetR35_2: R35.2 T3.2(G)

### Buses and harness runs
bus PORT[1..2] = port PORT[1..2]
bus RAS_PORT[1..2] = port RAS_PORT[1..2]
bus RDS_PORT[1..2] = port RDS_PORT[1..2]
bus WDS_PORT[1..2] = port WDS_PORT[1..2]

### Notes on the sheet
- (near C28) CLOSE TO IC5
- (near C29) CLOSE TO IC6
- IO PORTs
- (in symbol FDS89141, part A) 5,6
- (in symbol FDS89141, part B) 7,8

### Library data of the parts
C28 = CC0603_100NF_100V_10%_X7R: as C4 on sheet Power; Part Number: CC0603_100NF_100V_10%_X7R; Component Kind: Standard; Component Type: Standard; Pin Count: 2; Value: 100nF; Status: None; Manufacturer Part Number: CC0603_100NF_100V_10%_X7R; Case: 0603; Mounted: Yes; Socket: No; SMD: Yes; Sense: No; Manufacturer1 Example: MURATA; Manufacturer1 ComponentHeight: 0.9mm; HelpURL: \\cern.ch\dfs\Applications\Altium\Datasheets\CC0603_MURATA_GRM188R72A104KA35D.pdf; Author: CERN DEM JLC; CreateDate: 11.12.2013; LatestRevisionDate: 11.12.2013
C29 C30 C32 = CC0603_100NF_50V_10%_X7R: as C6 on sheet Power; Part Number: CC0603_100NF_50V_10%_X7R; Component Kind: Standard; Component Type: Standard; Pin Count: 2; Value: 100nF; Status: Preferred; Manufacturer Part Number: CC0603_100NF_50V_10%_X7R; Case: 0603; Mounted: Yes; Socket: No; SMD: Yes; Sense: No; Manufacturer1 Example: PHYCOMP; Manufacturer1 ComponentHeight: 0.87mm; HelpURL: \\cern.ch\dfs\Applications\Altium\Datasheets\CC0603_X7R_PHYCOMP.pdf; Author: CERN DEM JLC; CreateDate: 03.12.2007; LatestRevisionDate: 03.12.2007
C31 C33 = CC0603_1NF_50V_10%_X7R: Non-polarised capacitor; Part Description: SMD Multilayer Chip Ceramic Capacitor; Manufacturer: GENERIC; Manufacturer1 Part Number: 223858615623; Voltage: 50V; TC: X7R; Tolerance: ±10%; Part Number: CC0603_1NF_50V_10%_X7R; Component Kind: Standard; Component Type: Standard; Pin Count: 2; Value: 1nF; Status: Preferred; Manufacturer Part Number: CC0603_1NF_50V_10%_X7R; Case: 0603; Mounted: Yes; Socket: No; SMD: Yes; Sense: No; Manufacturer1 Example: PHYCOMP; Manufacturer1 ComponentHeight: 0.87mm; HelpURL: \\cern.ch\dfs\Applications\Altium\Datasheets\CC0603_X7R_PHYCOMP.pdf; Author: CERN DEM JLC; CreateDate: 03.12.2007; LatestRevisionDate: 03.12.2007
D7 D9 = SS24FL: as D1 on sheet Power; Part Number: SS24FL; Component Kind: Standard; Component Type: Standard; Device: SS24FL; PackageDescription: SODFL Diode (SOD123FL); 2.75mm W X 1.72mm L X 1.08mm H body, IPC Medium Density; Manufacturer Part Number: SS24FL; Pin Count: 2; Case: SOD-123FL; Mounted: Yes; Socket: No; SMD: Yes; Sense: No; ComponentHeight: 1.08mm; HelpURL: \\cern.ch\dfs\Applications\Altium\Datasheets\SS24FL.pdf; Author: CERN DEM BC; CreateDate: 06.10.2020; LatestRevisionDate: 06.10.2020
D8 D10 = MM3Z3V3T1G: Zener Diode; Part Description: Zener Voltage Regulator; Manufacturer: ON SEMICONDUCTOR; Voltage: 3.3V; Power: 200mW; PressFit: No; Bonding: No; Part Number: MM3Z3V3T1G; Component Kind: Standard; Component Type: Standard; Device: MM3Z3V3T1G; PackageDescription: Small Outline Diode (SOD-323), 1.70mm W X 1.25mm L X 1.10mm H body, IPC Medium Density; Manufacturer Part Number: MM3Z3V3T1G; Pin Count: 2; Case: SOD-323; Mounted: Yes; Socket: No; SMD: Yes; Sense: No; ComponentHeight: 1.1mm; HelpURL: \\cern.ch\dfs\Applications\Altium\Datasheets\MM3Z3V3T1G.pdf; Author: CERN DEM JLC; CreateDate: 13.11.2013; LatestRevisionDate: 13.11.2013
IC5 = LM358AD: Dual Operational Amplifier; Part Description: Dual Operational Amplifier, Vos=3mV, Iq/CH=350uA, 0°C to 70°C; Manufacturer: TEXAS INSTRUMENTS; PressFit: No; Bonding: No; Part Number: LM358AD; Component Kind: Standard; Component Type: Standard; Device: LM358AD; PackageDescription: SOIC 8, Pitch 1.27mm - Body 4x5mm, IPC Medium Density; Manufacturer Part Number: LM358AD; Pin Count: 8; Case: SOIC8; Mounted: Yes; Socket: No; SMD: Yes; Sense: No; ComponentHeight: 1.75mm; Author: CERN DEM JLC; HelpURL: \\cern.ch\dfs\Applications\Altium\Datasheets\LM358A.pdf; CreateDate: 02.12.2008; LatestRevisionDate: 06.09.2021
IC6 = SN74LVC2G17DBVR: Dual Schmitt-Trigger Buffer; Manufacturer: TEXAS INSTRUMENTS; PressFit: No; Bonding: No; Part Number: SN74LVC2G17DBVR; Component Kind: Standard; Component Type: Standard; Device: SN74LVC2G17DBVR; PackageDescription: SOT, 0.95mm Pitch; 6 Pin, 1.60mm W X 3.00mm L X 1.45mm H body, IPC Medium Density; Part Description: Dual Schmitt-Trigger Buffer; Manufacturer Part Number: SN74LVC2G17DBV; Pin Count: 6; Case: SOT23-6; Mounted: Yes; Socket: No; SMD: Yes; Sense: No; ComponentHeight: 1.45mm; Author: CERN DEM JLC; HelpURL: \\cern.ch\dfs\Applications\Altium\Datasheets\SN74LVC2G17DBVR.pdf; CreateDate: 25.11.2014; LatestRevisionDate: 25.11.2014
R24 R30 R34 R35 R41 R45 = R0603_430R_1%_0.1W_100PPM: as R4 on sheet Power; Part Number: R0603_430R_1%_0.1W_100PPM; Component Kind: Standard; Component Type: Standard; Pin Count: 2; Value: 430; Status: Preferred; Manufacturer Part Number: R0603_430R_1%_0.1W_100PPM; Case: 0603; Mounted: Yes; Sense: No; Socket: No; SMD: Yes; Manufacturer1 Example: NIC COMPONENT; Manufacturer1 ComponentHeight: 0.55mm; HelpURL: \\cern.ch\dfs\Applications\Altium\Datasheets\R0603_NIC_NRC.pdf; Author: CERN DEM JLC; CreateDate: 03.12.2007; LatestRevisionDate: 13.03.2008
R25 R27 R28 R32 R33 R36 R38 R39 R43 R44 = R0603_10K_1%_0.1W_100PPM: as R6 on sheet Power; Part Number: R0603_10K_1%_0.1W_100PPM; Component Kind: Standard; Component Type: Standard; Pin Count: 2; Value: 10k; Status: Preferred; Manufacturer Part Number: R0603_10K_1%_0.1W_100PPM; Case: 0603; Mounted: Yes; Sense: No; Socket: No; SMD: Yes; Manufacturer1 Example: NIC COMPONENT; Manufacturer1 ComponentHeight: 0.55mm; HelpURL: \\cern.ch\dfs\Applications\Altium\Datasheets\R0603_NIC_NRC.pdf; Author: CERN DEM JLC; CreateDate: 03.12.2007; LatestRevisionDate: 13.03.2008
R26 R37 = R1206_10K_1%_0.25W_100PPM: as R3 on sheet Power; Part Number: R1206_10K_1%_0.25W_100PPM; Component Kind: Standard; Component Type: Standard; Pin Count: 2; Value: 10k; Status: Preferred; Manufacturer Part Number: R1206_10K_1%_0.25W_100PPM; Case: 1206; Mounted: Yes; Sense: No; Socket: No; SMD: Yes; Manufacturer1 Example: NIC COMPONENT; Manufacturer1 ComponentHeight: 0.65mm; HelpURL: \\cern.ch\dfs\Applications\Altium\Datasheets\R1206_NIC_NRC.pdf; Author: CERN DEM JLC; CreateDate: 03.12.2007; LatestRevisionDate: 13.03.2008
R29 R40 = R0603_20K_1%_0.1W_100PPM: Resistor - 1%; Part Description: General Purpose Thick Film Chip Resistor; Manufacturer: GENERIC; Manufacturer1 Part Number: NRC06F2002TRF; Power: 0.1W; TC: ±100ppm/°C; PressFit: No; Part Number: R0603_20K_1%_0.1W_100PPM; Component Kind: Standard; Component Type: Standard; Pin Count: 2; Value: 20k; Status: Preferred; Manufacturer Part Number: R0603_20K_1%_0.1W_100PPM; Case: 0603; Mounted: Yes; Sense: No; Socket: No; SMD: Yes; Manufacturer1 Example: NIC COMPONENT; Manufacturer1 ComponentHeight: 0.55mm; HelpURL: \\cern.ch\dfs\Applications\Altium\Datasheets\R0603_NIC_NRC.pdf; Author: CERN DEM JLC; CreateDate: 03.12.2007; LatestRevisionDate: 13.03.2008
R31 R42 = R0603_1K_1%_0.1W_100PPM: as R5 on sheet Power; Part Number: R0603_1K_1%_0.1W_100PPM; Component Kind: Standard; Component Type: Standard; Pin Count: 2; Value: 1k; Status: Preferred; Manufacturer Part Number: R0603_1K_1%_0.1W_100PPM; Case: 0603; Mounted: Yes; Sense: No; Socket: No; SMD: Yes; Manufacturer1 Example: NIC COMPONENT; Manufacturer1 ComponentHeight: 0.55mm; HelpURL: \\cern.ch\dfs\Applications\Altium\Datasheets\R0603_NIC_NRC.pdf; Author: CERN DEM JLC; CreateDate: 03.12.2007; LatestRevisionDate: 13.03.2008
T3 = FDS89141: 100V Dual N-Channel PowerTrench® MOSFET; Part Description: 100V, Dual N-Channel PowerTrench® MOSFET; Manufacturer: FAIRCHILD SEMICONDUCTOR; PressFit: No; Bonding: No; Part Number: FDS89141; Component Kind: Standard; Component Type: Standard; Device: FDS89141; PackageDescription: SOIC 8, Pitch 1.27mm - Body 4x5mm, IPC Medium Density; Manufacturer Part Number: FDS89141; Pin Count: 8; Case: SOIC8; Mounted: Yes; Socket: No; SMD: Yes; Sense: No; ComponentHeight: 1.75mm; HelpURL: \\cern.ch\dfs\Applications\Altium\Datasheets\FDS89141.pdf; Author: CERN DEM JLC; CreateDate: 15.11.2016; LatestRevisionDate: 15.11.2016

## Sheet LEDs.SchDoc
size A4; SheetNumber: 11; SheetTotal: 11
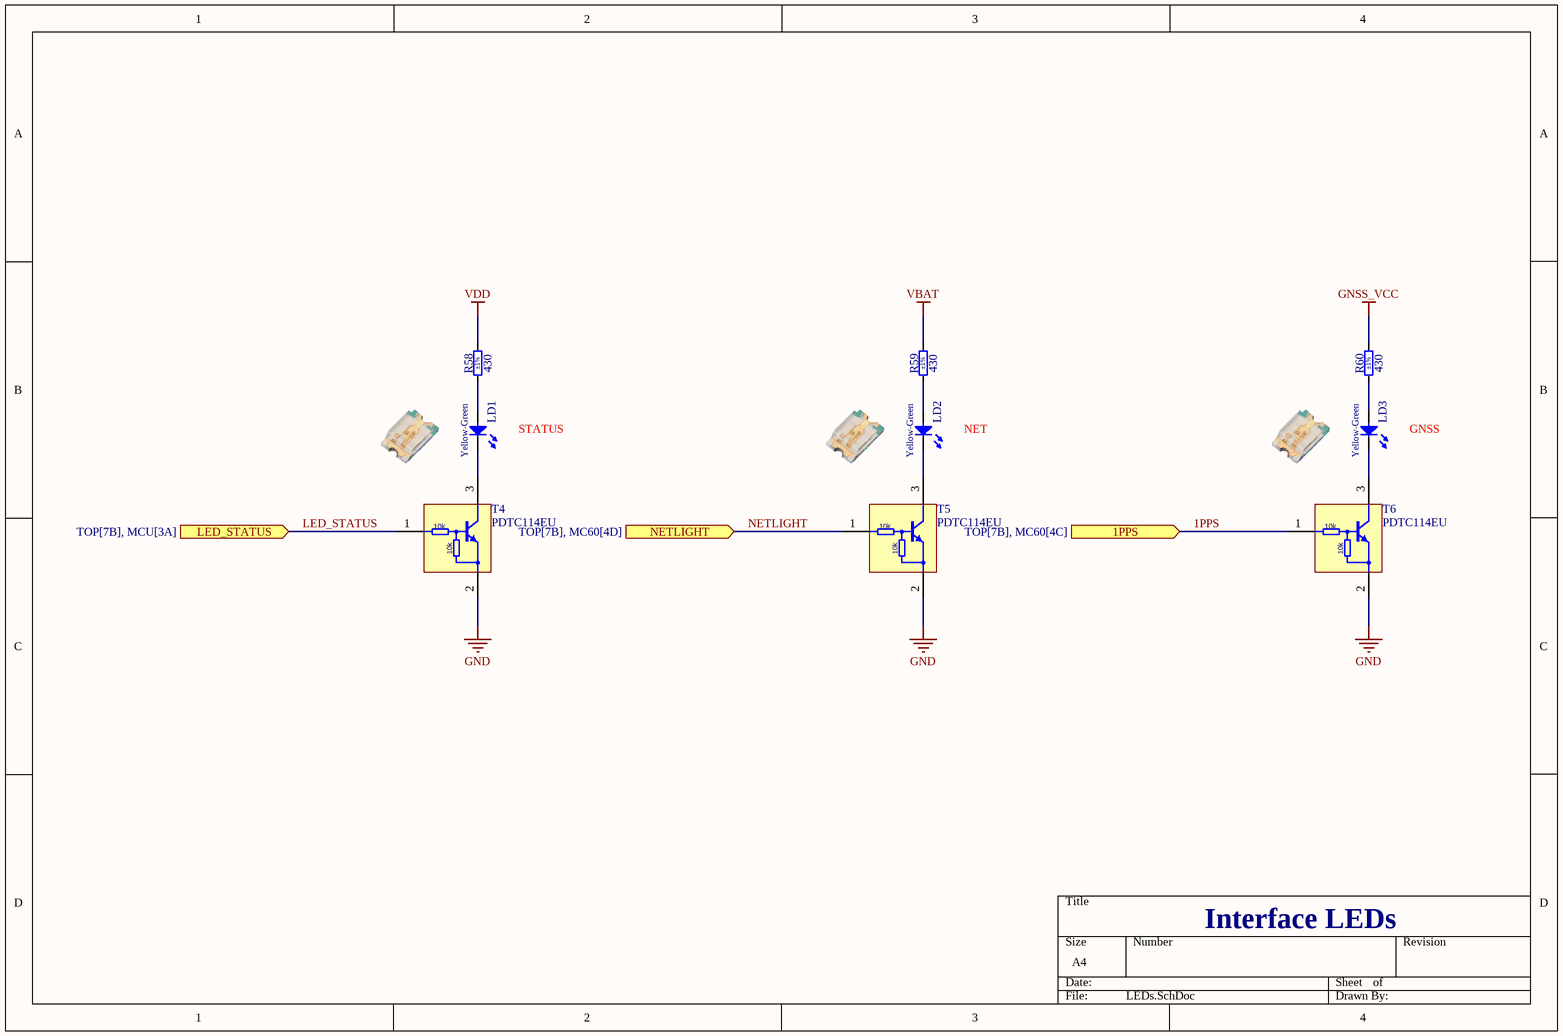
[diagram p10: LEDs.SchDoc]

### Parts
LD1  Yellow-Green  [LED_DIALIGHT_598-8060-107F]
LD2  Yellow-Green  [LED_DIALIGHT_598-8060-107F]
LD3  Yellow-Green  [LED_DIALIGHT_598-8060-107F]
R58  430  Tolerance: ±1%  [RESC1608X55N]
R59  430  Tolerance: ±1%  [RESC1608X55N]
R60  430  Tolerance: ±1%  [RESC1608X55N]
T4  PDTC114EU  [SOT65P210X100-3N]
T5  PDTC114EU  [SOT65P210X100-3N]
T6  PDTC114EU  [SOT65P210X100-3N]

### Ports
1PPS (in, see TOP[7B], MC60[4C]), LED_STATUS (in, see TOP[7B], MCU[3A]), NETLIGHT (in, see TOP[7B], MC60[4D])

### Nets
GND: T4.2(E) T5.2(E) T6.2(E)
GNSS_VCC: R60.2
VBAT: R59.2
VDD: R58.2
1PPS: T6.1(B) ; port 1PPS
LED_STATUS: T4.1(B) ; port LED_STATUS
NETLIGHT: T5.1(B) ; port NETLIGHT
NetLD1_1: LD1.1(C) T4.3(C)
NetLD1_2: LD1.2(A) R58.1
NetLD2_1: LD2.1(C) T5.3(C)
NetLD2_2: LD2.2(A) R59.1
NetLD3_1: LD3.1(C) T6.3(C)
NetLD3_2: LD3.2(A) R60.1

### Notes on the sheet
- STATUS
- NET
- GNSS
- Interface LEDs
- (in symbol PDTC114EU) 10k

### Library data of the parts
LD1-LD3 = LED_DIALIGHT_598-8060-107F: LED Yellow-Green 1C 2A; Part Description: Micro SMD Yellow-Green Led, 598 Series; PressFit: No; Bonding: No; Part Number: LED_DIALIGHT_598-8060-107F; Component Kind: Standard; Component Type: Standard; Color: Yellow-Green; PackageDescription: SMT Yellow-Green LED, Body 1.6x0.8mm, 0603 Case,  DIALIGHT 598 Series; Manufacturer: DIALIGHT; Manufacturer Part Number: 598-8060-107F; Pin Count: 2; Case: 0603; Mounted: Yes; Socket: No; SMD: Yes; Sense: No; ComponentHeight: 0.7mm; HelpURL: \\cern.ch\dfs\Applications\Altium\Datasheets\LED_DIALIGHT_598-8060-107F.pdf; Author: CERN DEM JLC; CreateDate: 13.02.2017; LatestRevisionDate: 13.02.2017
R58-R60 = R0603_430R_1%_0.1W_100PPM: as R4 on sheet Power; Part Number: R0603_430R_1%_0.1W_100PPM; Component Kind: Standard; Component Type: Standard; Pin Count: 2; Value: 430; Status: Preferred; Manufacturer Part Number: R0603_430R_1%_0.1W_100PPM; Case: 0603; Mounted: Yes; Sense: No; Socket: No; SMD: Yes; Manufacturer1 Example: NIC COMPONENT; Manufacturer1 ComponentHeight: 0.55mm; HelpURL: \\cern.ch\dfs\Applications\Altium\Datasheets\R0603_NIC_NRC.pdf; Author: CERN DEM JLC; CreateDate: 03.12.2007; LatestRevisionDate: 13.03.2008
T4-T6 = PDTC114EU: Pre-Biased Bipolar Transistor (BJT) NPN - Pre-Biased 50 V 100 mA 200 mW Surface Mount SOT-323; Manufacturer: Nexperia USA Inc.; PressFit: No; Bonding: No; Part Number: PDTC114EU; Component Kind: Standard; Component Type: Standard; Device: PDTC114EU; PackageDescription: SOT323, 0.65mm pitch; 3 pin, 1.25mm W X 2.00mm L, IPC Medium Density; Part Description: Pre-Biased Bipolar Transistor (BJT) NPN - Pre-Biased 50 V 100 mA 200 mW Surface Mount SOT-323; Manufacturer Part Number: PDTC114EU; Pin Count: 3; Case: SOT-323; Mounted: Yes; Socket: No; SMD: Yes; Sense: No; ComponentHeight: 0.8mm; HelpURL: https://assets.nexperia.com/documents/data-sheet/PDTC114E_SER.pdf; Author: Xusniyor; CreateDate: 22.04.2023; LatestRevisionDate: 22.04.2023

## Nets that join several sheets
GND: TOP (5 pins), MC60 (20 pins), MCU (C15.1 C16.1 IC3.3 IC3.21), EEPROM (C27.2 IC4.4 R23.1), SIM (9 pins), Power (23 pins), RS485 (C39.2 D12.3 IC7.5 R57.1), IOs (16 pins), LEDs (T4.2 T5.2 T6.2)
GNSS_VCC: TOP (TP5.1), MC60 (C25.2 C26.2 PCBM1.26), Power (C14.2 IC2.5 R7.2), LEDs (R60.2)
POWER: TOP (F1.2 TP1.1), Power (D1.2), IOs (D7.1 D9.1)
VBAT: TOP (TP4.1), MC60 (6 pins), EEPROM (5 pins), SIM (D11.5), Power (5 pins), LEDs (R59.2)
VDD: TOP (TP3.1), MCU (11 pins), Power (9 pins), RS485 (6 pins), IOs (C29.2 IC6.5), LEDs (R58.2)
VIN: TOP (TP2.1), Power (8 pins), IOs (C28.2 IC5.8 R27.2 R38.2)
VRTC: TOP (TP6.1), MC60 (PCBM1.52), Power (BAT1.1 D6.1)
1PPS: MC60 (PCBM1.17), LEDs (T6.1)
EEPROM_CLK: MC60 (PCBM1.62), EEPROM (IC4.6 R23.2)
EEPROM_CS: MC60 (PCBM1.59), EEPROM (IC4.1 R22.1)
EEPROM_MISO: MC60 (PCBM1.61), EEPROM (R21.1)
EEPROM_MOSI: MC60 (PCBM1.60), EEPROM (IC4.5)
GNSS_VCC_EN: MC60 (PCBM1.28), Power (IC2.3 R9.2)
LED_STATUS: MCU (IC3.17), LEDs (T4.1)
MAIN_RXD: MC60 (PCBM1.34), RS485 (R54.1)
MAIN_TXD: MC60 (PCBM1.33), RS485 (IC7.4 R49.1)
MC60_PWRKEY: MC60 (T2.1), MCU (IC3.20)
MC60_VBAT_EN: MCU (IC3.5), Power (R6.1 R8.1)
MCU_INT: MC60 (PCBM1.37), MCU (IC3.1 R12.2)
MCU_SCL: MC60 (PCBM1.35), MCU (IC3.14 R10.2)
MCU_SDA: MC60 (PCBM1.36), MCU (IC3.13 R11.2)
MCU_WDI: MC60 (PCBM1.38), MCU (IC3.2 R13.2)
NETLIGHT: MC60 (PCBM1.47), LEDs (T5.1)
RAS_PORT1: MCU (IC3.6), IOs (R34.2)
RAS_PORT2: MCU (IC3.7), IOs (R45.2)
RAS_VIN: MCU (IC3.8), Power (R4.2)
RDS_PORT1: MCU (IC3.15), IOs (R30.2)
RDS_PORT2: MCU (IC3.16), IOs (R41.2)
RS458_DE: MC60 (PCBM1.39), RS485 (IC7.2 IC7.3 R51.1)
SIM1_CLK: MC60 (PCBM1.19), SIM (R47.1)
SIM1_DATA: MC60 (PCBM1.21), SIM (R48.1)
SIM1_GND: MC60 (PCBM1.16), SIM (C34.1 D11.6 J3.C5)
SIM1_RST: MC60 (PCBM1.20), SIM (R46.1)
SIM1_VDD: MC60 (PCBM1.18), SIM (C34.2 C38.2 J3.C1)
WDS_PORT1: MCU (IC3.10), IOs (R24.1 R25.2)
WDS_PORT2: MCU (IC3.9), IOs (R35.1 R36.2)